# Altium schematic sheet Power-MCU.SchDoc
size 431 x 279 mm; SheetNumber: 1; SheetTotal: 2
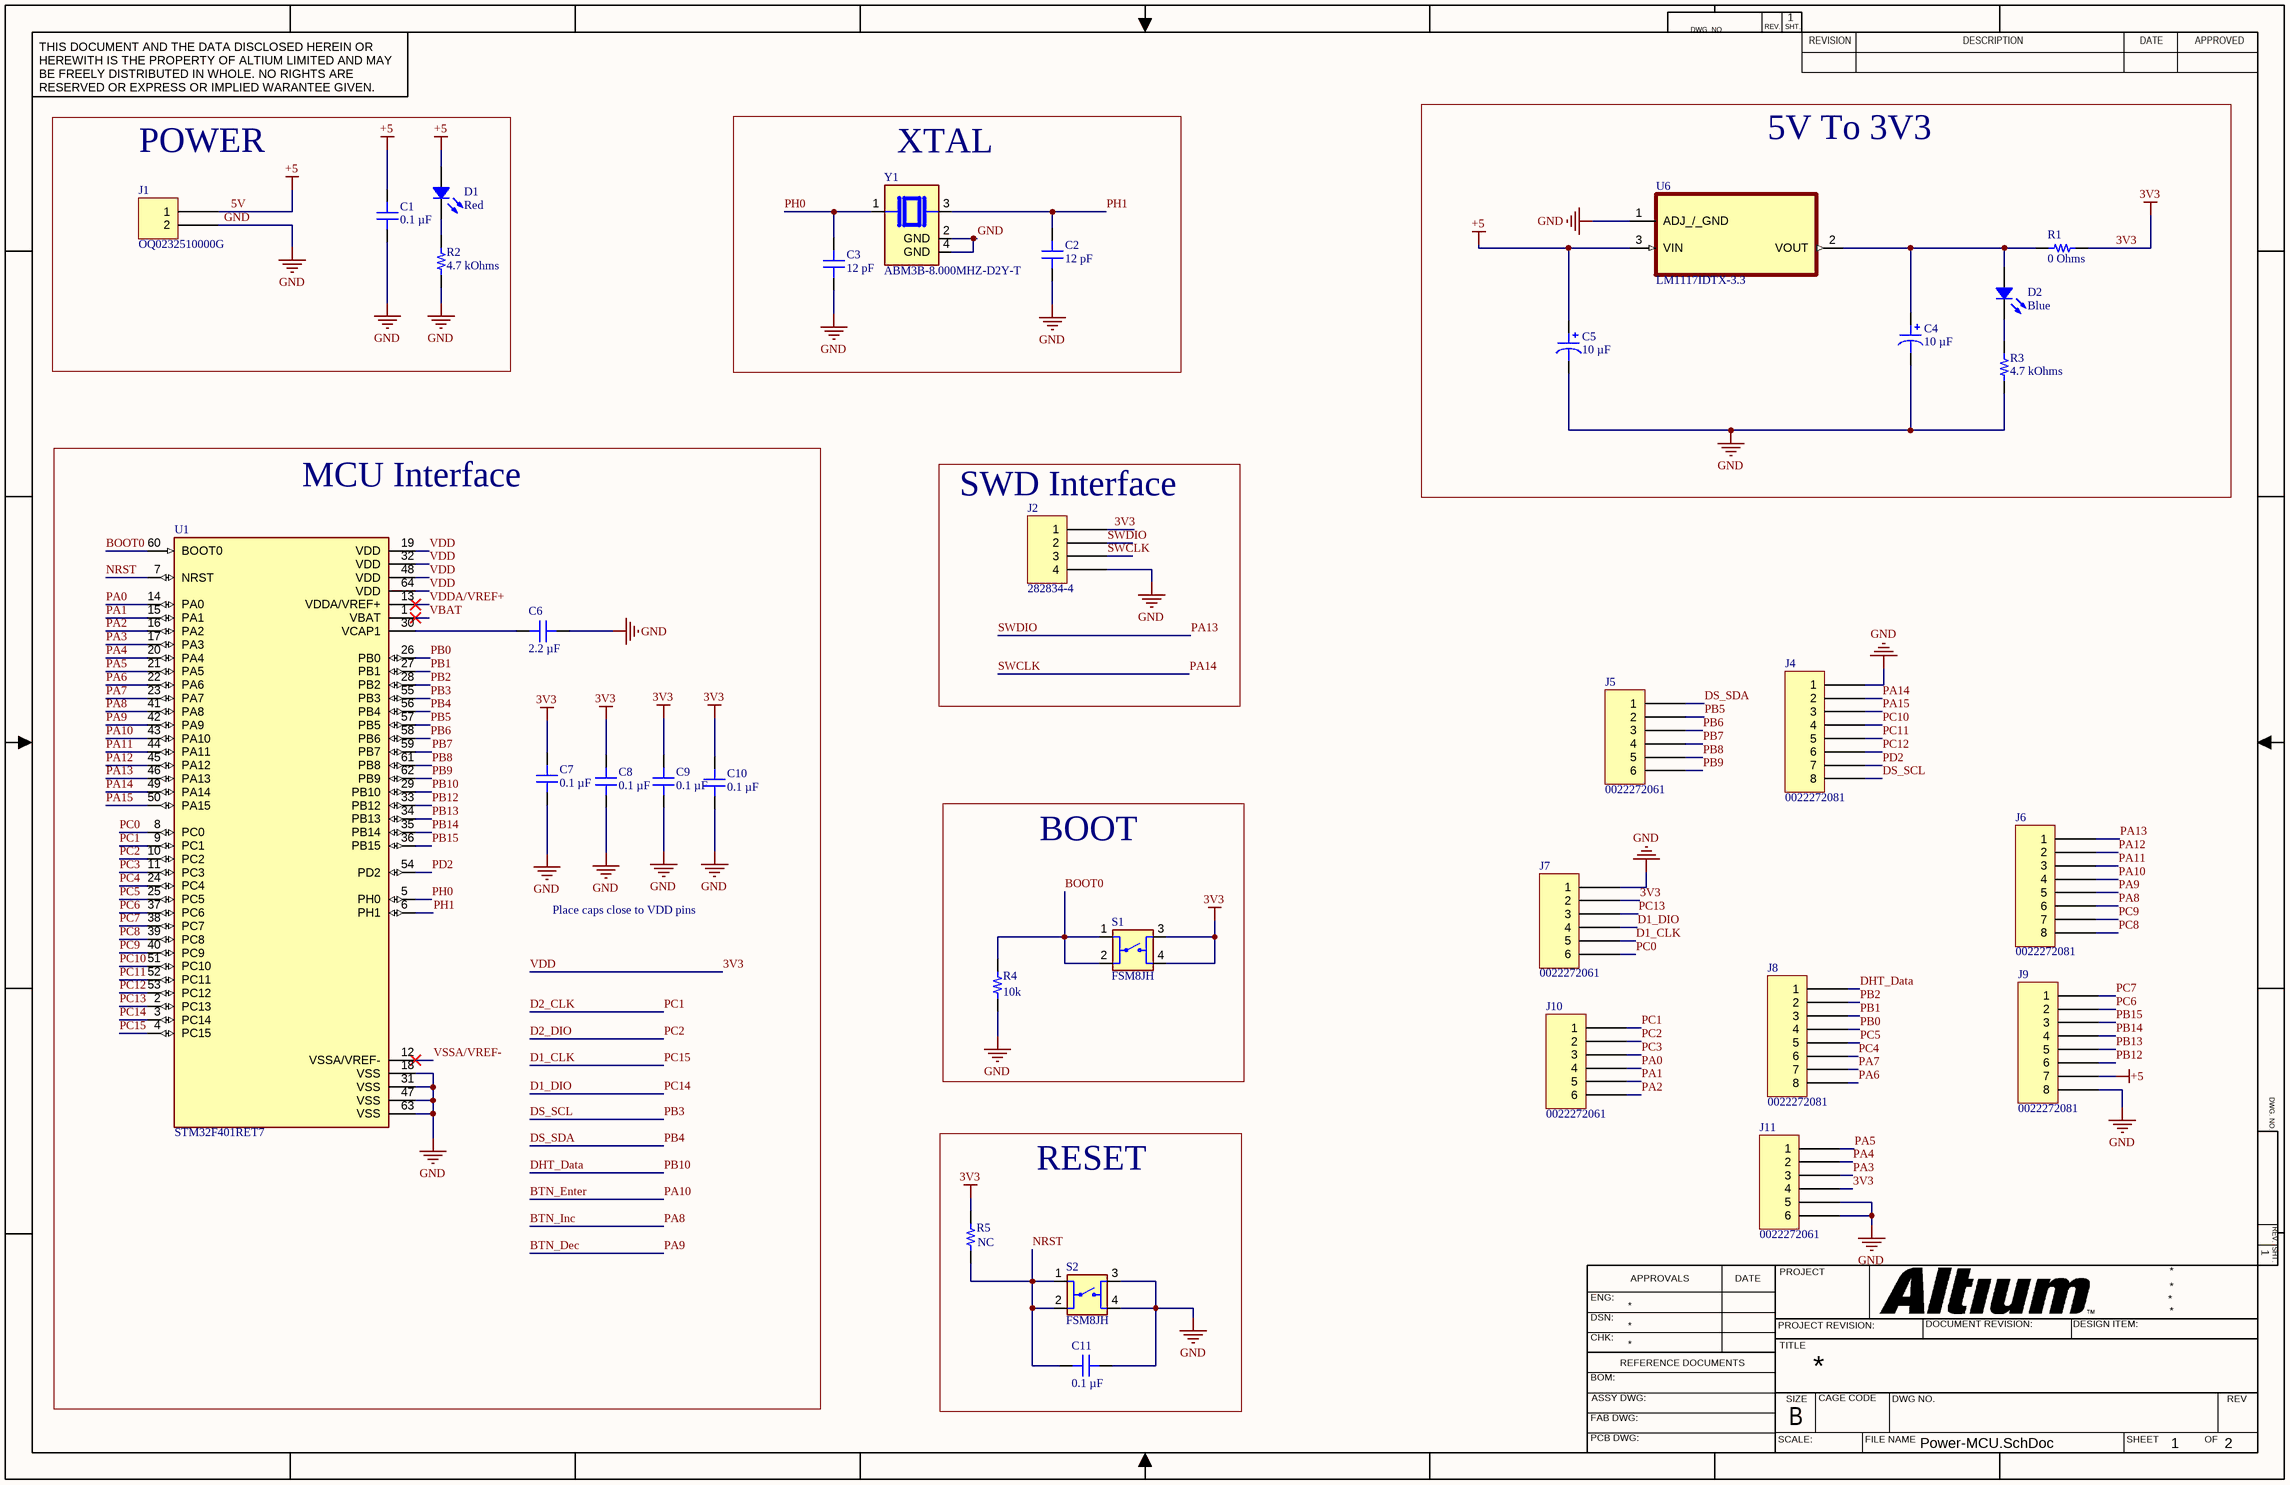
[diagram p0: Power-MCU.SchDoc]

## Parts
C1  0.1 µF  [CAP 0805_2012]
C2  12 pF  [CAP 0402_1005]
C3  12 pF  [CAP 0402_1005]
C4  10 µF  [CAP POL 1411_3528]
C5  10 µF  [CAP POL 1411_3528]
C6  2.2 µF  [CAP 0805_2012]
C7  0.1 µF  [CAP 0805_2012]
C8  0.1 µF  [CAP 0805_2012]
C9  0.1 µF  [CAP 0805_2012]
C10  0.1 µF  [CAP 0805_2012]
C11  0.1 µF  [CAP 0805_2012]
D1  Red  [LED 0805_2012 RED]
D2  Blue  [LED 0805_2012 RED]
J1  OQ0232510000G  [FCI 06-381-2PIN]
J2  282834-4  [TE 282834-4]
J4  0022272081  [MOLEX KK 0022272081]
J5  0022272061  [MOLEX KK 0022272061]
J6  0022272081  [MOLEX KK 0022272081]
J7  0022272061  [MOLEX KK 0022272061]
J8  0022272081  [MOLEX KK 0022272081]
J9  0022272081  [MOLEX KK 0022272081]
J10  0022272061  [MOLEX KK 0022272061]
J11  0022272061  [MOLEX KK 0022272061]
R1  0 Ohms  [RES 0805_2012]
R2  4.7 kOhms  [RES 0805_2012]
R3  4.7 kOhms  [RES 0805_2012]
R4  10k Ohms  [RES 0805_2012]  (value not drawn)
R5  NC  [RES 0805_2012]  (value not drawn)
S1  FSM8JH  [SW_FSM8JH]
S2  FSM8JH  [SW_FSM8JH]
U1  STM32F401RET7  [LQFP-64]
U6  LM1117IDTX-3.3  [TO252-3]
Y1  ABM3B-8.000MHZ-D2Y-T  [XTAL_ABM3B-8.000MHZ-D2Y-T]

## Blocks framed on the sheet
5V To 3V3: C4 C5 D2 R1 R3 U6
POWER: C1 D1 J1 R2
XTAL: C2 C3 Y1
MCU Interface: C6-C10 U1
SWD Interface: J2
BOOT: R4 S1
RESET: C11 R5 S2

## Nets
3V3: C7.2 C8.2 C9.2 C10.2 J2.1 J7.2 J11.4 R1.2 R5.2 S1.3 S1.4 U1.19(VDD) U1.32(VDD) U1.48(VDD) U1.64(VDD)  [also labelled VDD]
5V: C1.2 C5.1 D1.1 J1.1 J9.7 U6.3(VIN)  [also labelled +5]
GND: C1.1 C2.1 C3.1 C4.2 C5.2 C6.2 C7.1 C8.1 C9.1 C10.1 C11.1 J1.2 J2.4 J4.1 J7.1 J9.8 J11.5 J11.6 R2.1 R3.1 R4.1 S2.3 S2.4 U1.18(VSS) U1.31(VSS) U1.47(VSS) U1.63(VSS) U6.1(ADJ_/_GND) Y1.2(GND) Y1.4(GND)
BOOT0: R4.2 S1.1 S1.2 U1.60(BOOT0)
BTN_Dec: J6.5 U1.42(PA9)  [also labelled PA9]
BTN_Enter: J6.4 U1.43(PA10)  [also labelled PA10]
BTN_Inc: J6.6 U1.41(PA8)  [also labelled PA8]
D1_CLK: J7.5 U1.4(PC15)  [also labelled PC15]
D1_DIO: J7.4 U1.3(PC14)  [also labelled PC14]
D2_CLK: J10.1 U1.9(PC1)  [also labelled PC1]
D2_DIO: J10.2 U1.10(PC2)  [also labelled PC2]
DHT_Data: J8.1 U1.29(PB10)  [also labelled PB10]
DS_SCL: J4.8 U1.55(PB3)  [also labelled PB3]
DS_SDA: J5.1 U1.56(PB4)  [also labelled PB4]
NRST: C11.2 R5.1 S2.1 S2.2 U1.7(NRST)
PA0: J10.4 U1.14(PA0)
PA1: J10.5 U1.15(PA1)
PA2: J10.6 U1.16(PA2)
PA3: J11.3 U1.17(PA3)
PA4: J11.2 U1.20(PA4)
PA5: J11.1 U1.21(PA5)
PA6: J8.8 U1.22(PA6)
PA7: J8.7 U1.23(PA7)
PA11: J6.3 U1.44(PA11)
PA12: J6.2 U1.45(PA12)
PA13: J2.2 J6.1 U1.46(PA13)  [also labelled SWDIO]
PA14: J2.3 J4.2 U1.49(PA14)  [also labelled SWCLK]
PA15: J4.3 U1.50(PA15)
PB0: J8.4 U1.26(PB0)
PB1: J8.3 U1.27(PB1)
PB2: J8.2 U1.28(PB2)
PB5: J5.2 U1.57(PB5)
PB6: J5.3 U1.58(PB6)
PB7: J5.4 U1.59(PB7)
PB8: J5.5 U1.61(PB8)
PB9: J5.6 U1.62(PB9)
PB12: J9.6 U1.33(PB12)
PB13: J9.5 U1.34(PB13)
PB14: J9.4 U1.35(PB14)
PB15: J9.3 U1.36(PB15)
PC0: J7.6 U1.8(PC0)
PC3: J10.3 U1.11(PC3)
PC4: J8.6 U1.24(PC4)
PC5: J8.5 U1.25(PC5)
PC6: J9.2 U1.37(PC6)
PC7: J9.1 U1.38(PC7)
PC8: J6.8 U1.39(PC8)
PC9: J6.7 U1.40(PC9)
PC10: J4.4 U1.51(PC10)
PC11: J4.5 U1.52(PC11)
PC12: J4.6 U1.53(PC12)
PC13: J7.3 U1.2(PC13)
PD2: J4.7 U1.54(PD2)
PH0: C3.2 U1.5(PH0) Y1.1
PH1: C2.2 U1.6(PH1) Y1.3
VBAT: U1.1(VBAT)
VDDA/VREF+: U1.13(VDDA/VREF+)
VSSA/VREF-: U1.12(VSSA/VREF-)
NetC4_1: C4.1 D2.1 R1.1 U6.2(VOUT)
NetC6_1: C6.1 U1.30(VCAP1)
NetD1_2: D1.2 R2.2
NetD2_2: D2.2 R3.2

## Notes on the sheet
- Place caps close to VDD pins
- (near R4) 10k
- (near R5) NC
- DWG. NO.
- REV.
- SHT.
- THIS DOCUMENT AND THE DATA DISCLOSED HEREIN OR HEREWITH IS THE PROPERTY OF ALTIUM LIMITED AND MAY BE FREELY DISTRIBUTED IN WHOLE. NO RIGHTS ARE RESERVED OR EXPRESS OR IMPLIED WARANTEE GIVEN.
- REVISION
- DESCRIPTION
- DATE
- APPROVED
- ENG:
- APPROVALS
- PROJECT
- DSN:
- CHK:
- REFERENCE DOCUMENTS
- PROJECT REVISION:
- TITLE
- DOCUMENT REVISION:
- DESIGN ITEM:
- BOM:
- FAB DWG:
- PCB DWG:
- ASSY DWG:
- SCALE:
- SIZE
- B
- CAGE CODE
- FILE NAME
- DWG NO.
- SHEET
- OF
- REV

## Library data of the parts
C1 C7-C11 = HMK212BJ104KG-T: CAP CER 0.1UF 100V X5R 0805; manufacturer: Taiyo Yuden; Tolerance: ±10%; Part Number: HMK212BJ104KG-T; Capacitance: 0.1 µF; Applications: SMPS Filtering; componentlink1description: Datasheet; componentlink1url: https://www.yuden.co.jp/productdata/catalog/mlcc01_e.pdf; componentlink2description: DigiKey Link; componentlink2url: https://www.digikey.com/en/products/detail/taiyo-yuden/HMK212BJ104KG-T/4970697; Device Package: 0805 (2012 Metric); Features: High Voltage; lastupdated: 9.02.2024 20:16:06; Lifecycle Status: Active; Minimum Order: 1; Mounting Type: Surface Mount, MLCC; Operating Temperature: -55°C ~ 85°C; Package / Case: 0805 (2012 Metric); packaging: TapeAndReel; partid: 3711; Part Status: Active; price: 0.03; series: M; Size / Dimension: 0.079" L x 0.049" W (2.00mm x 1.25mm); Supplier 1: DigiKey; Supplier Part Number 1: 587-5863-1-ND; Temperature Coefficient: X5R; Thickness (Max): 0.053" (1.35mm); value: 0.1 µF; Voltage - Rated: 100V
C2 C3 = CBR04C120F5GAC: CAP CER 12PF 50V C0G/NP0 0402; manufacturer: KEMET; Temperature Coefficient: C0G, NP0; Tolerance: ±1%; Part Number: CBR04C120F5GAC; Capacitance: 12 pF; Applications: RF, Microwave, High Frequency; componentlink1description: Datasheet; componentlink1url: https://api.kemet.com/component-edge/download/datasheet/CBR04C120F5GAC.pdf; componentlink2description: DigiKey Link; componentlink2url: https://www.digikey.com/en/products/detail/kemet/CBR04C120F5GAC/3479654; Device Package: 0402 (1005 Metric); Features: High Q, Low Loss, Ultra Low ESR; lastupdated: 9.02.2024 20:04:38; Lifecycle Status: Active; Minimum Order: 1; Mounting Type: Surface Mount, MLCC; Operating Temperature: -55°C ~ 125°C; Package / Case: 0402 (1005 Metric); packaging: TapeAndReel; partid: 1750; Part Status: Active; price: 0.06; series: CBR-SMD RF C0G; Size / Dimension: 0.039" L x 0.020" W (1.00mm x 0.50mm); Supplier 1: DigiKey; Supplier Part Number 1: 399-8815-1-ND; Thickness (Max): 0.022" (0.55mm); value: 12 pF; Voltage - Rated: 50V
C4 C5 = T491T106K016AT: CAP TANT 10UF 10% 16V 1411; manufacturer: KEMET; Manufacturer Size Code: T; ESR (Equivalent Series Resistance): 8Ohm; Lifetime @ Temp.: 2000 Hrs @ 125°C; Type: Molded; Part Number: T491T106K016AT; Value: 10 µF; Capacitance: 10 µF; componentlink1description: Datasheet; componentlink1url: https://api.kemet.com/component-edge/download/datasheet/T491T106K016AT.pdf; componentlink2description: DigiKey Link; componentlink2url: https://www.digikey.com/en/products/detail/kemet/T491T106K016AT/2336362; Device Package: 1411 (3528 Metric); Features: General Purpose; Height - Seated (Max): 0.047" (1.20mm); lastupdated: 3.06.2024 19:29:03; Lifecycle Status: Active; Minimum Order: 1; Mounting Type: Surface Mount; Operating Temperature: -55°C ~ 125°C; Package / Case: 1411 (3528 Metric); packaging: TapeAndReel; partid: 5; Part Status: Active; price: 0.42; series: T491; Size / Dimension: 0.138" L x 0.110" W (3.50mm x 2.80mm); Supplier 1: DigiKey; Supplier Part Number 1: 399-8400-1-ND; Tolerance: ±10%; Voltage - Rated: 16 V
C6 = CL21A225KB9LNNC: CAP CER 2.2UF 50V X5R 0805; manufacturer: Samsung Electro-Mechanics; Tolerance: ±10%; Part Number: CL21A225KB9LNNC; Capacitance: 2.2 µF; Applications: General Purpose; componentlink1description: Datasheet; componentlink1url: http://www.samsungsem.com/kr/support/product-search/mlcc/CL21A225KB9LNNC.jsp; componentlink2description: DigiKey Link; componentlink2url: https://www.digikey.com/en/products/detail/samsung-electro-mechanics/CL21A225KB9LNNC/3888067; Device Package: 0805 (2012 Metric); Features: Low Profile; lastupdated: 9.02.2024 20:16:07; Lifecycle Status: Active; Minimum Order: 1; Mounting Type: Surface Mount, MLCC; Operating Temperature: -55°C ~ 85°C; Package / Case: 0805 (2012 Metric); packaging: TapeAndReel; partid: 3097; Part Status: Active; price: 0.04; series: CL; Size / Dimension: 0.079" L x 0.049" W (2.00mm x 1.25mm); Supplier 1: DigiKey; Supplier Part Number 1: 1276-2409-1-ND; Temperature Coefficient: X5R; Thickness (Max): 0.039" (1.00mm); value: 2.2 µF; Voltage - Rated: 50V
D1 D2 = SM0805URC: LED RED CLEAR 0805 SMD; Manufacturer: Bivar Inc.; Configuration: Standard; Current - Test: 20mA; Lens Color: Colorless; Lens Size: 1.40mm x 1.20mm; Lens Style: Rectangle with Flat Top; Millicandela Rating: 55mcd; Viewing Angle: 130°; Voltage - Forward (Vf) (Typ): 2.1V; Wavelength - Dominant: 640nm; Wavelength - Peak: 655nm; Part Number: SM0805URC; Color: Red; ComponentLink1Description: Datasheet; ComponentLink1URL: https://www.bivar.com/Files/Datasheets/SM0805URC.pdf; ComponentLink2Description: DigiKey Link; ComponentLink2URL: https://www.digikey.com/en/products/detail/bivar-inc/SM0805URC/528906; Device Package: 0805 (2012 Metric); Height (Max): 1.10mm; LastUpdated: 3.06.2024 20:00:06; Lens Transparency: Clear; Lifecycle Status: Active; Minimum Order: 1; Mounting Type: Surface Mount; Package / Case: 0805 (2012 Metric); Packaging: TapeAndReel; PartId: 317; Part Status: Active; Price: 0.17; Series: -; Size / Dimension: 2.00mm L x 1.20mm W; Supplier 1: DigiKey; Supplier Part Number 1: 492-1350-1-ND; Supplier Device Package: 0805; Value: Red
J1 = OQ0232510000G: TERM BLOCK HDR 2POS 90DEG 3.81MM; Manufacturer: Amphenol Anytek; Current - UL: 10A; Header Orientation: 90°, Right Angle; Number of Levels: 1; Number of Positions: 2; Pitch: 0.150" (3.81mm); Voltage - UL: 300V; Part Number: OQ0232510000G; Color: Green; ComponentLink1Description: Datasheet; ComponentLink1URL: http://portal.fciconnect.com/Comergent//fci/drawing/oqxx32x100j0g.pdf; ComponentLink2Description: DigiKey Link; ComponentLink2URL: //digikey.com/product-detail/en/amphenol-anytek/OQ0232510000G/609-3819-ND/2261255; Contact Mating Finish: Tin; LastUpdated: 16.12.2019 19:14:30; Lifecycle Status: 0; Minimum Order: 1; Mounting Type: Through Hole; Operating Temperature: -40°C ~ 115°C; Packaging: Bulk; Part Status: Active; Positions Per Level: 2; Price: 0.49; Series: 06-381; Supplier 1: DigiKey; Supplier Part Number 1: 609-3819-ND; Termination Style: Solder; Type: Header, Male Pins, Shrouded (4 Side)
J2 = 282834-4: TERM BLK 4P SIDE ENT 2.54MM PCB; Manufacturer: TE Connectivity AMP Connectors; Current: 10A; Mating Orientation: Horizontal with Board; Number of Levels: 1; Pitch: 0.100" (2.54mm); Positions Per Level: 4; Voltage: 150V; Wire Gauge: 16-30 AWG; Wire Termination: Screw - Rising Cage Clamp; Part Number: 282834-4; Color: Green; ComponentLink1Description: Datasheet; ComponentLink1URL: https://www.te.com/commerce/DocumentDelivery/DDEController?Action=srchrtrv&DocNm=282834&DocType=Customer+Drawing&DocLang=English; ComponentLink2Description: DigiKey Link; ComponentLink2URL: http://digikey.com/product-detail/en/te-connectivity-amp-connectors/282834-4/A98335-ND/1153265; LastUpdated: 15.01.2020 04:16:05; Lifecycle Status: Active; Minimum Order: 1; Mounting Type: Through Hole; Packaging: Bulk; Part Status: Active; Price: 2.68; Series: Buchanan; Supplier 1: DigiKey; Supplier Part Number 1: A98335-ND
J4 J6 J8 J9 = 0022272081: CONN HEADER VERT 8POS 2.54MM; Manufacturer: Molex; Contact Length - Mating: 0.295" (7.49mm); Contact Length - Post: 0.140" (3.56mm); Material Flammability Rating: UL94 V-0; Number of Positions: 8; Number of Positions Loaded: All; Overall Contact Length: 0.560" (14.22mm); Pitch - Mating: 0.100" (2.54mm); Shrouding: Shrouded - 1 Wall; Style: Board to Cable/Wire; Part Number: 0022272081; ComponentLink1Description: Datasheet; ComponentLink1URL: https://www.molex.com/pdm_docs/sd/022272081_sd.pdf; ComponentLink2Description: DigiKey Link; ComponentLink2URL: http://digikey.com/product-detail/en/molex/0022272081/WM4117-ND/1130583; Connector Type: Header; Contact Finish - Mating: Tin; Contact Finish - Post: Tin; Contact Finish Thickness - Mating: 100.0µin (2.54µm); Contact Material: Brass; Contact Shape: Square; Contact Type: Male Pin; Fastening Type: Friction Lock; Insulation Color: Natural; Insulation Height: 0.461" (11.70mm); Insulation Material: Polyamide (PA), Nylon; LastUpdated: 12.01.2020 23:52:41; Lifecycle Status: Active; Minimum Order: 1; Mounting Type: Through Hole; Number of Rows: 1; Packaging: Bulk; PartId: 82; Part Status: Active; Price: 0.60; Series: KK 6410; Supplier 1: DigiKey; Supplier Part Number 1: WM4117-ND; Termination: Solder
J5 J7 J10 J11 = 0022272061: CONN HEADER VERT 6POS 2.54MM; Manufacturer: Molex; Contact Length - Mating: 0.295" (7.49mm); Contact Length - Post: 0.140" (3.56mm); Material Flammability Rating: UL94 V-0; Number of Positions: 6; Number of Positions Loaded: All; Overall Contact Length: 0.560" (14.22mm); Pitch - Mating: 0.100" (2.54mm); Shrouding: Shrouded - 1 Wall; Style: Board to Cable/Wire; Part Number: 0022272061; ComponentLink1Description: Datasheet; ComponentLink1URL: https://www.molex.com/pdm_docs/sd/022272061_sd.pdf; ComponentLink2Description: DigiKey Link; ComponentLink2URL: http://digikey.com/product-detail/en/molex/0022272061/WM4115-ND/1130581; Connector Type: Header; Contact Finish - Mating: Tin; Contact Finish - Post: Tin; Contact Finish Thickness - Mating: 100.0µin (2.54µm); Contact Material: Brass; Contact Shape: Square; Contact Type: Male Pin; Fastening Type: Friction Lock; Insulation Color: Natural; Insulation Height: 0.461" (11.70mm); Insulation Material: Polyamide (PA), Nylon; LastUpdated: 12.01.2020 23:52:24; Lifecycle Status: Active; Minimum Order: 1; Mounting Type: Through Hole; Number of Rows: 1; Packaging: Bulk; PartId: 80; Part Status: Active; Price: 0.49; Series: KK 6410; Supplier 1: DigiKey; Supplier Part Number 1: WM4115-ND; Termination: Solder
R1 = TLRZ2ATTD: RES 0 OHM JUMPER 0805; Manufacturer: KOA Speer Electronics, Inc.; Part Number: TLRZ2ATTD; Value: 0 Ohms; ComponentLink1Description: Datasheet; ComponentLink1URL: http://www.koaspeer.com/catimages/Products/TLRZ/TLRZ.pdf; ComponentLink2Description: DigiKey Link; ComponentLink2URL: https://www.digikey.com/en/products/detail/koa-speer-electronics-inc/TLRZ2ATTD/9845494; Composition: Metal Element; Device Package: 0805 (2012 Metric); Features: Automotive AEC-Q200, Current Sense; Height - Seated (Max): 0.022" (0.55mm); LastUpdated: 8.02.2024 21:02:39; Lifecycle Status: Active; Minimum Order: 1; Number of Terminations: 2; Operating Temperature: -55°C ~ 170°C; Package / Case: 0805 (2012 Metric); Packaging: TapeAndReel; PartId: 27685; Part Status: Active; Price: 0.08; Ratings: AEC-Q200; Resistance: 0 Ohms; Series: TLRZ; Size / Dimension: 0.079" L x 0.049" W (2.00mm x 1.25mm); Supplier 1: DigiKey; Supplier Part Number 1: 2019-TLRZ2ATTDCT-ND; Supplier Device Package: 0805; Tolerance: Jumper
R2 R3 = CRGH0805F4K7: CRGH0805 1% 4K7 0.33W; Manufacturer: TE Connectivity Passive Product; Power (Watts): 0.333W, 1/3W; Temperature Coefficient: ±100ppm/°C; Part Number: CRGH0805F4K7; Value: 4.7 kOhms; ComponentLink1Description: Datasheet; ComponentLink1URL: https://www.te.com/commerce/DocumentDelivery/DDEController?Action=srchrtrv&DocNm=1773204-1&DocType=DS&DocLang=English; ComponentLink2Description: DigiKey Link; ComponentLink2URL: https://www.digikey.com/en/products/detail/te-connectivity-passive-product/CRGH0805F4K7/7495027; Composition: Thick Film; Device Package: 0805 (2012 Metric); Height - Seated (Max): 0.026" (0.65mm); LastUpdated: 8.02.2024 21:01:27; Lifecycle Status: Active; Minimum Order: 1; Number of Terminations: 2; Operating Temperature: -55°C ~ 155°C; Package / Case: 0805 (2012 Metric); Packaging: TapeAndReel; PartId: 44424; Part Status: Active; Price: 0.01; Resistance: 4.7 kOhms; Series: CRGH, Neohm; Size / Dimension: 0.079" L x 0.049" W (2.00mm x 1.25mm); Supplier 1: DigiKey; Supplier Part Number 1: A129546CT-ND; Supplier Device Package: 0805; Tolerance: ±1%
R4 R5 = TLRZ2ATTD: RES 0 OHM JUMPER 0805; Manufacturer: KOA Speer Electronics, Inc.; Value: 0 Ohms; Part Number: TLRZ2ATTD; ComponentLink1Description: Datasheet; ComponentLink1URL: http://www.koaspeer.com/catimages/Products/TLRZ/TLRZ.pdf; ComponentLink2Description: DigiKey Link; ComponentLink2URL: https://www.digikey.com/en/products/detail/koa-speer-electronics-inc/TLRZ2ATTD/9845494; Composition: Metal Element; Device Package: 0805 (2012 Metric); Features: Automotive AEC-Q200, Current Sense; Height - Seated (Max): 0.022" (0.55mm); LastUpdated: 8.02.2024 21:02:39; Lifecycle Status: Active; Minimum Order: 1; Number of Terminations: 2; Operating Temperature: -55°C ~ 170°C; Package / Case: 0805 (2012 Metric); Packaging: TapeAndReel; PartId: 27685; Part Status: Active; Price: 0.08; Ratings: AEC-Q200; Resistance: 0 Ohms; Series: TLRZ; Size / Dimension: 0.079" L x 0.049" W (2.00mm x 1.25mm); Supplier 1: DigiKey; Supplier Part Number 1: 2019-TLRZ2ATTDCT-ND; Supplier Device Package: 0805; Tolerance: Jumper
S1 S2 = FSM8JH: Tactile Switch SPST-NO Top Actuated Through Hole; MF: TE Connectivity; Check_prices: https://www.snapeda.com/parts/FSM8JH/TE+Connectivity+ALCOSWITCH+Switches/view-part/?ref=eda; Value: *; Availability: In Stock; MP: FSM8JH; Price: None; Package: None; SnapEDA_Link: https://www.snapeda.com/parts/FSM8JH/TE+Connectivity+ALCOSWITCH+Switches/view-part/?ref=snap
U1 = STM32F401RET7: ARMÂ®CortexÂ®-M4STM32F4å¾®æŽ§åˆ¶å™¨IC 32ä½84MHz 512KBï¼ˆ512K x 8ï¼‰FLASH 64-LQFPï¼ˆ10x10ï¼‰; MF: STMicroelectronics; MP: STM32F401RET7; Mouser-Purchase-URL: https://snapeda.com/shop?store=Mouser&id=1149062; Value: *; Package: LQFP-64 STMicroelectronics; Availability: Unavailable; Price: None; SnapEDA_Link: https://www.snapeda.com/parts/STM32F401RET7/STMicroelectronics/view-part/1149062/?ref=snap
U6 = LM1117IDTX-3.3: Linear Voltage Regulator IC 1 Output 800mA TO-252-3; MF: Texas Instruments; Check_prices: https://www.snapeda.com/parts/LM1117IDTX-3.3/Texas%20Instruments/view-part/497954/?ref=eda; SnapEDA_Link: https://www.snapeda.com/parts/LM1117IDTX-3.3/Texas%20Instruments/view-part/497954/?ref=snap; Package: TO-252-3 Texas Instruments; Digi-Key_Part_Number: LM1117IDTX-3.3/NOPBCT-ND; MP: LM1117IDTX-3.3; Value: *
Y1 = ABM3B-8.000MHZ-D2Y-T: Crystal 8MHz Â±20ppm (Tol) Â±30ppm (Stability) 18pF FUND 200Ohm 4-Pin CSMD T/R; MF: Abracon LLC; Value: *; Availability: In Stock; SnapEDA_Link: https://www.snapeda.com/parts/ABM3B-8.000MHZ-D2Y-T/Abracon+LLC/view-part/?ref=snap; Check_prices: https://www.snapeda.com/parts/ABM3B-8.000MHZ-D2Y-T/Abracon+LLC/view-part/?ref=eda; Package: Package; Purchase-URL: https://pricing.snapeda.com/search/part/ABM3B-8.000MHZ-D2Y-T/?ref=eda; MP: ABM3B-8.000MHZ-D2Y-T; Price: None